# Altium schematic sheet IPA-Safety-Relay-SubSch.SchDoc
size Letter
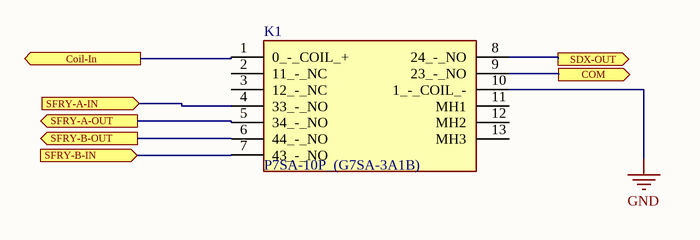
[diagram p0: IPA-Safety-Relay-SubSch.SchDoc]

## Parts
K1  P7SA-10P_(G7SA-3A1B)  [P7SA10PG7SA2A2B]

## Ports
Coil-In (out), COM (out), SDX-OUT (out), SFRY-A-IN (in), SFRY-A-OUT (out), SFRY-B-IN (in), SFRY-B-OUT (out)

## Nets
GND: K1.10(1_-_COIL_-)
Coil-In: K1.1(0_-_COIL_+) ; port Coil-In
COM: K1.9(23_-_NO) ; port COM
SDX-OUT: K1.8(24_-_NO) ; port SDX-OUT
SFRY-A-IN: K1.4(33_-_NO) ; port SFRY-A-IN
SFRY-A-OUT: K1.5(34_-_NO) ; port SFRY-A-OUT
SFRY-B-IN: K1.7(43_-_NO) ; port SFRY-B-IN
SFRY-B-OUT: K1.6(44_-_NO) ; port SFRY-B-OUT

Not connected (* = marked no-connect by the designer): K1 2(11_-_NC) 3(12_-_NC) 11(MH1) 12(MH2) 13(MH3)

## Library data of the parts
K1 = P7SA-10P_(G7SA-3A1B): Relay or Contactor; Manufacturer_Name: Omron Electronics; Manufacturer_Part_Number: P7SA-10P (G7SA-3A1B); Allied_Number: 70033653; Datasheet Link: http://www.ia.omron.com/data_pdf/cat/g7sa_j120-e1_12_1_csm1269.pdf; Mouser Part Number: 653-P7SA-10P; Mouser Price/Stock: https://www.mouser.com/Search/Refine.aspx?Keyword=653-P7SA-10P; Allied Price/Stock: https://www.alliedelec.com/omron-safety-sti-p7sa-10p/70033653/